# Altium schematic sheet Rose LanteRn.SchDoc
size A4; Organization: TESLA Motors, INC; Address1: 3500 Deer Creek Road; Address2: Palo Alto, CA; Address4: U.S.A.; SheetNumber: 1; SheetTotal: 1
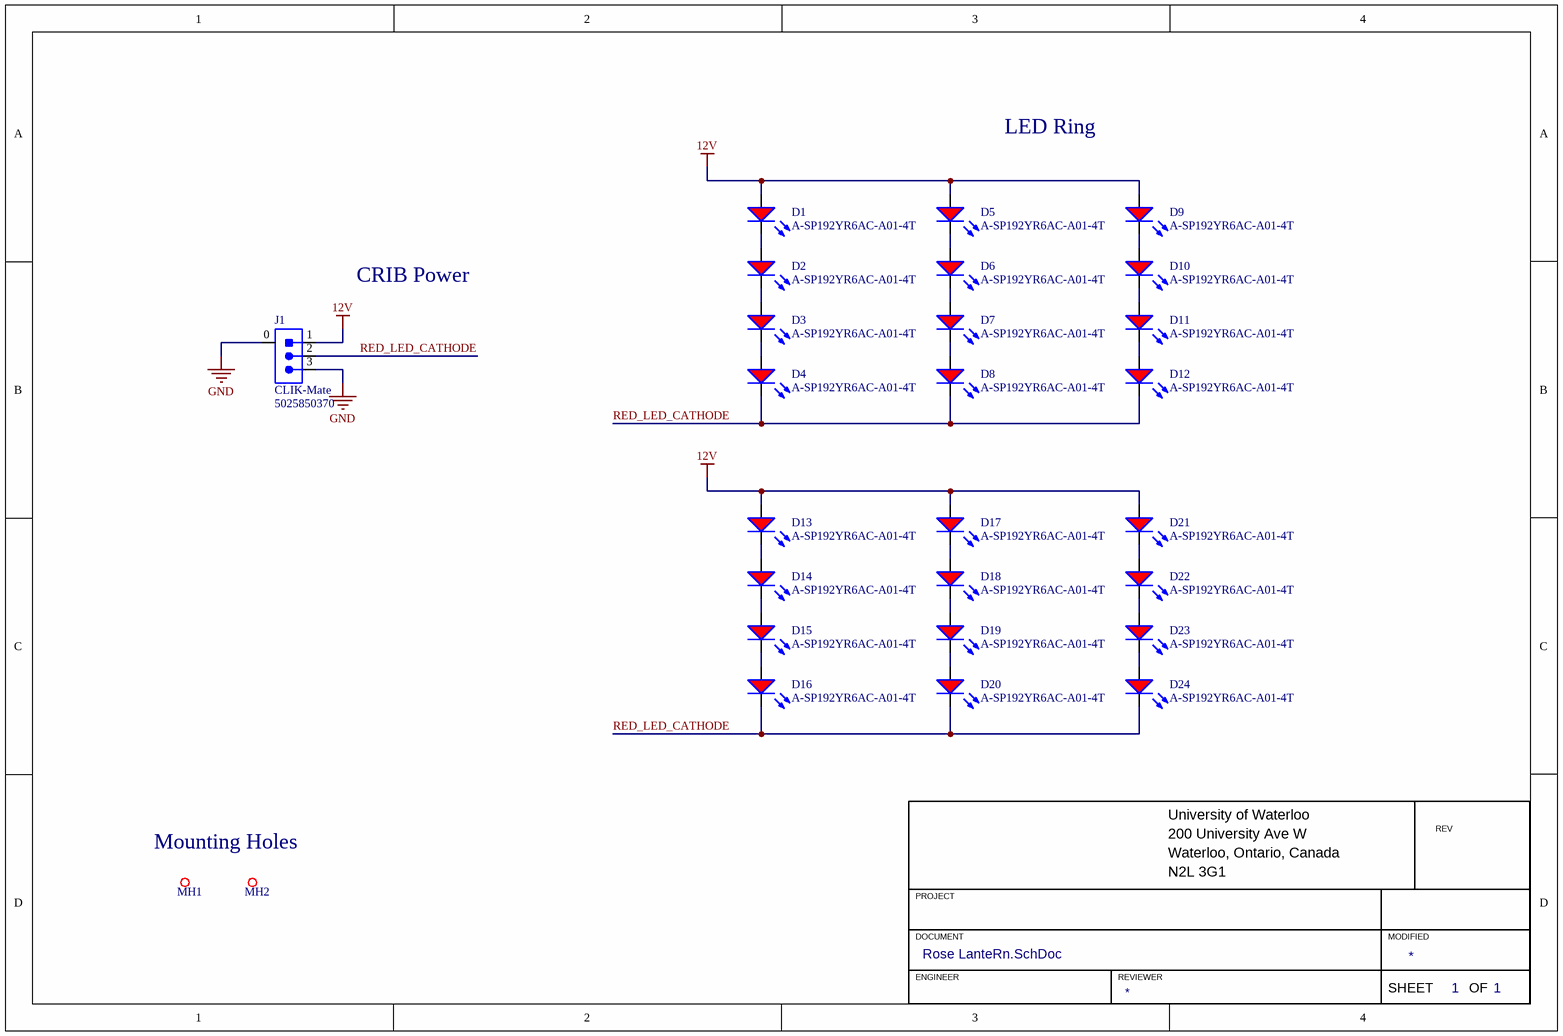
[diagram p0: Rose LanteRn.SchDoc]

## Parts
D1  Manufacturer Part Number 1: A-SP192YR6AC-A01-4T  [LED_0603_RED]  (hidden comment: LED_RED_0603)
D2  Manufacturer Part Number 1: A-SP192YR6AC-A01-4T  [LED_0603_RED]  (hidden comment: LED_RED_0603)
D3  Manufacturer Part Number 1: A-SP192YR6AC-A01-4T  [LED_0603_RED]  (hidden comment: LED_RED_0603)
D4  Manufacturer Part Number 1: A-SP192YR6AC-A01-4T  [LED_0603_RED]  (hidden comment: LED_RED_0603)
D5  Manufacturer Part Number 1: A-SP192YR6AC-A01-4T  [LED_0603_RED]  (hidden comment: LED_RED_0603)
D6  Manufacturer Part Number 1: A-SP192YR6AC-A01-4T  [LED_0603_RED]  (hidden comment: LED_RED_0603)
D7  Manufacturer Part Number 1: A-SP192YR6AC-A01-4T  [LED_0603_RED]  (hidden comment: LED_RED_0603)
D8  Manufacturer Part Number 1: A-SP192YR6AC-A01-4T  [LED_0603_RED]  (hidden comment: LED_RED_0603)
D9  Manufacturer Part Number 1: A-SP192YR6AC-A01-4T  [LED_0603_RED]  (hidden comment: LED_RED_0603)
D10  Manufacturer Part Number 1: A-SP192YR6AC-A01-4T  [LED_0603_RED]  (hidden comment: LED_RED_0603)
D11  Manufacturer Part Number 1: A-SP192YR6AC-A01-4T  [LED_0603_RED]  (hidden comment: LED_RED_0603)
D12  Manufacturer Part Number 1: A-SP192YR6AC-A01-4T  [LED_0603_RED]  (hidden comment: LED_RED_0603)
D13  Manufacturer Part Number 1: A-SP192YR6AC-A01-4T  [LED_0603_RED]  (hidden comment: LED_RED_0603)
D14  Manufacturer Part Number 1: A-SP192YR6AC-A01-4T  [LED_0603_RED]  (hidden comment: LED_RED_0603)
D15  Manufacturer Part Number 1: A-SP192YR6AC-A01-4T  [LED_0603_RED]  (hidden comment: LED_RED_0603)
D16  Manufacturer Part Number 1: A-SP192YR6AC-A01-4T  [LED_0603_RED]  (hidden comment: LED_RED_0603)
D17  Manufacturer Part Number 1: A-SP192YR6AC-A01-4T  [LED_0603_RED]  (hidden comment: LED_RED_0603)
D18  Manufacturer Part Number 1: A-SP192YR6AC-A01-4T  [LED_0603_RED]  (hidden comment: LED_RED_0603)
D19  Manufacturer Part Number 1: A-SP192YR6AC-A01-4T  [LED_0603_RED]  (hidden comment: LED_RED_0603)
D20  Manufacturer Part Number 1: A-SP192YR6AC-A01-4T  [LED_0603_RED]  (hidden comment: LED_RED_0603)
D21  Manufacturer Part Number 1: A-SP192YR6AC-A01-4T  [LED_0603_RED]  (hidden comment: LED_RED_0603)
D22  Manufacturer Part Number 1: A-SP192YR6AC-A01-4T  [LED_0603_RED]  (hidden comment: LED_RED_0603)
D23  Manufacturer Part Number 1: A-SP192YR6AC-A01-4T  [LED_0603_RED]  (hidden comment: LED_RED_0603)
D24  Manufacturer Part Number 1: A-SP192YR6AC-A01-4T  [LED_0603_RED]  (hidden comment: LED_RED_0603)
J1  Family: CLIK-Mate  Manufacturer Part Number 1: 5025850370  [MOLEX-5025850370]  (hidden comment: CON_3M_SM_RA)
MH1  MOUNTING_HOLE_M3  [MOUNTING_HOLE_3mm]  (value not drawn)  (no BOM)
MH2  MOUNTING_HOLE_M3  [MOUNTING_HOLE_3mm]  (value not drawn)  (no BOM)

## Nets
12V: D1.2(A) D5.2(A) D9.2(A) D13.2(A) D17.2(A) D21.2(A) J1.1
GND: J1.0 J1.3
RED_LED_CATHODE: D4.1(K) D8.1(K) D12.1(K) D16.1(K) D20.1(K) D24.1(K) J1.2
NetD1_1: D1.1(K) D2.2(A)
NetD2_1: D2.1(K) D3.2(A)
NetD3_1: D3.1(K) D4.2(A)
NetD5_1: D5.1(K) D6.2(A)
NetD6_1: D6.1(K) D7.2(A)
NetD7_1: D7.1(K) D8.2(A)
NetD9_1: D9.1(K) D10.2(A)
NetD10_1: D10.1(K) D11.2(A)
NetD11_1: D11.1(K) D12.2(A)
NetD13_1: D13.1(K) D14.2(A)
NetD14_1: D14.1(K) D15.2(A)
NetD15_1: D15.1(K) D16.2(A)
NetD17_1: D17.1(K) D18.2(A)
NetD18_1: D18.1(K) D19.2(A)
NetD19_1: D19.1(K) D20.2(A)
NetD21_1: D21.1(K) D22.2(A)
NetD22_1: D22.1(K) D23.2(A)
NetD23_1: D23.1(K) D24.2(A)

## Notes on the sheet
- LED Ring
- CRIB Power
- Mounting Holes
- University of Waterloo
- 200 University Ave W
- REV
- PROJECT
- Waterloo, Ontario, Canada
- N2L 3G1
- DOCUMENT
- ENGINEER
- REVIEWER
- MODIFIED
- SHEET
- OF

## Library data of the parts
D1-D24 = LED_RED_0603: LED RED DIFFUSED 0805 SMD; Manufacturer 1: Amicc; Package/Footprint: 0603; Forward Voltage Drop: 2.3V; Supplier Part Number 1: C5355430; Supplier 1: LCSC; Mounting Type: SMD
J1 = CON_3M_SM_RA: CONN RCPT 3POS 0.059 TIN SMD R/A; Manufacturer 1: Molex; Current Rating: 2A; Voltage Rating: 100V; Pitch: 1.5mm; Supplier 1: Digi-Key; Mounting Type: SMD; Package/Footprint: SMD; Orientation: Right Angle; Supplier Part Number 1: WM12831CT-ND